# EAGLE design weddingbot (EAGLE 6.1)
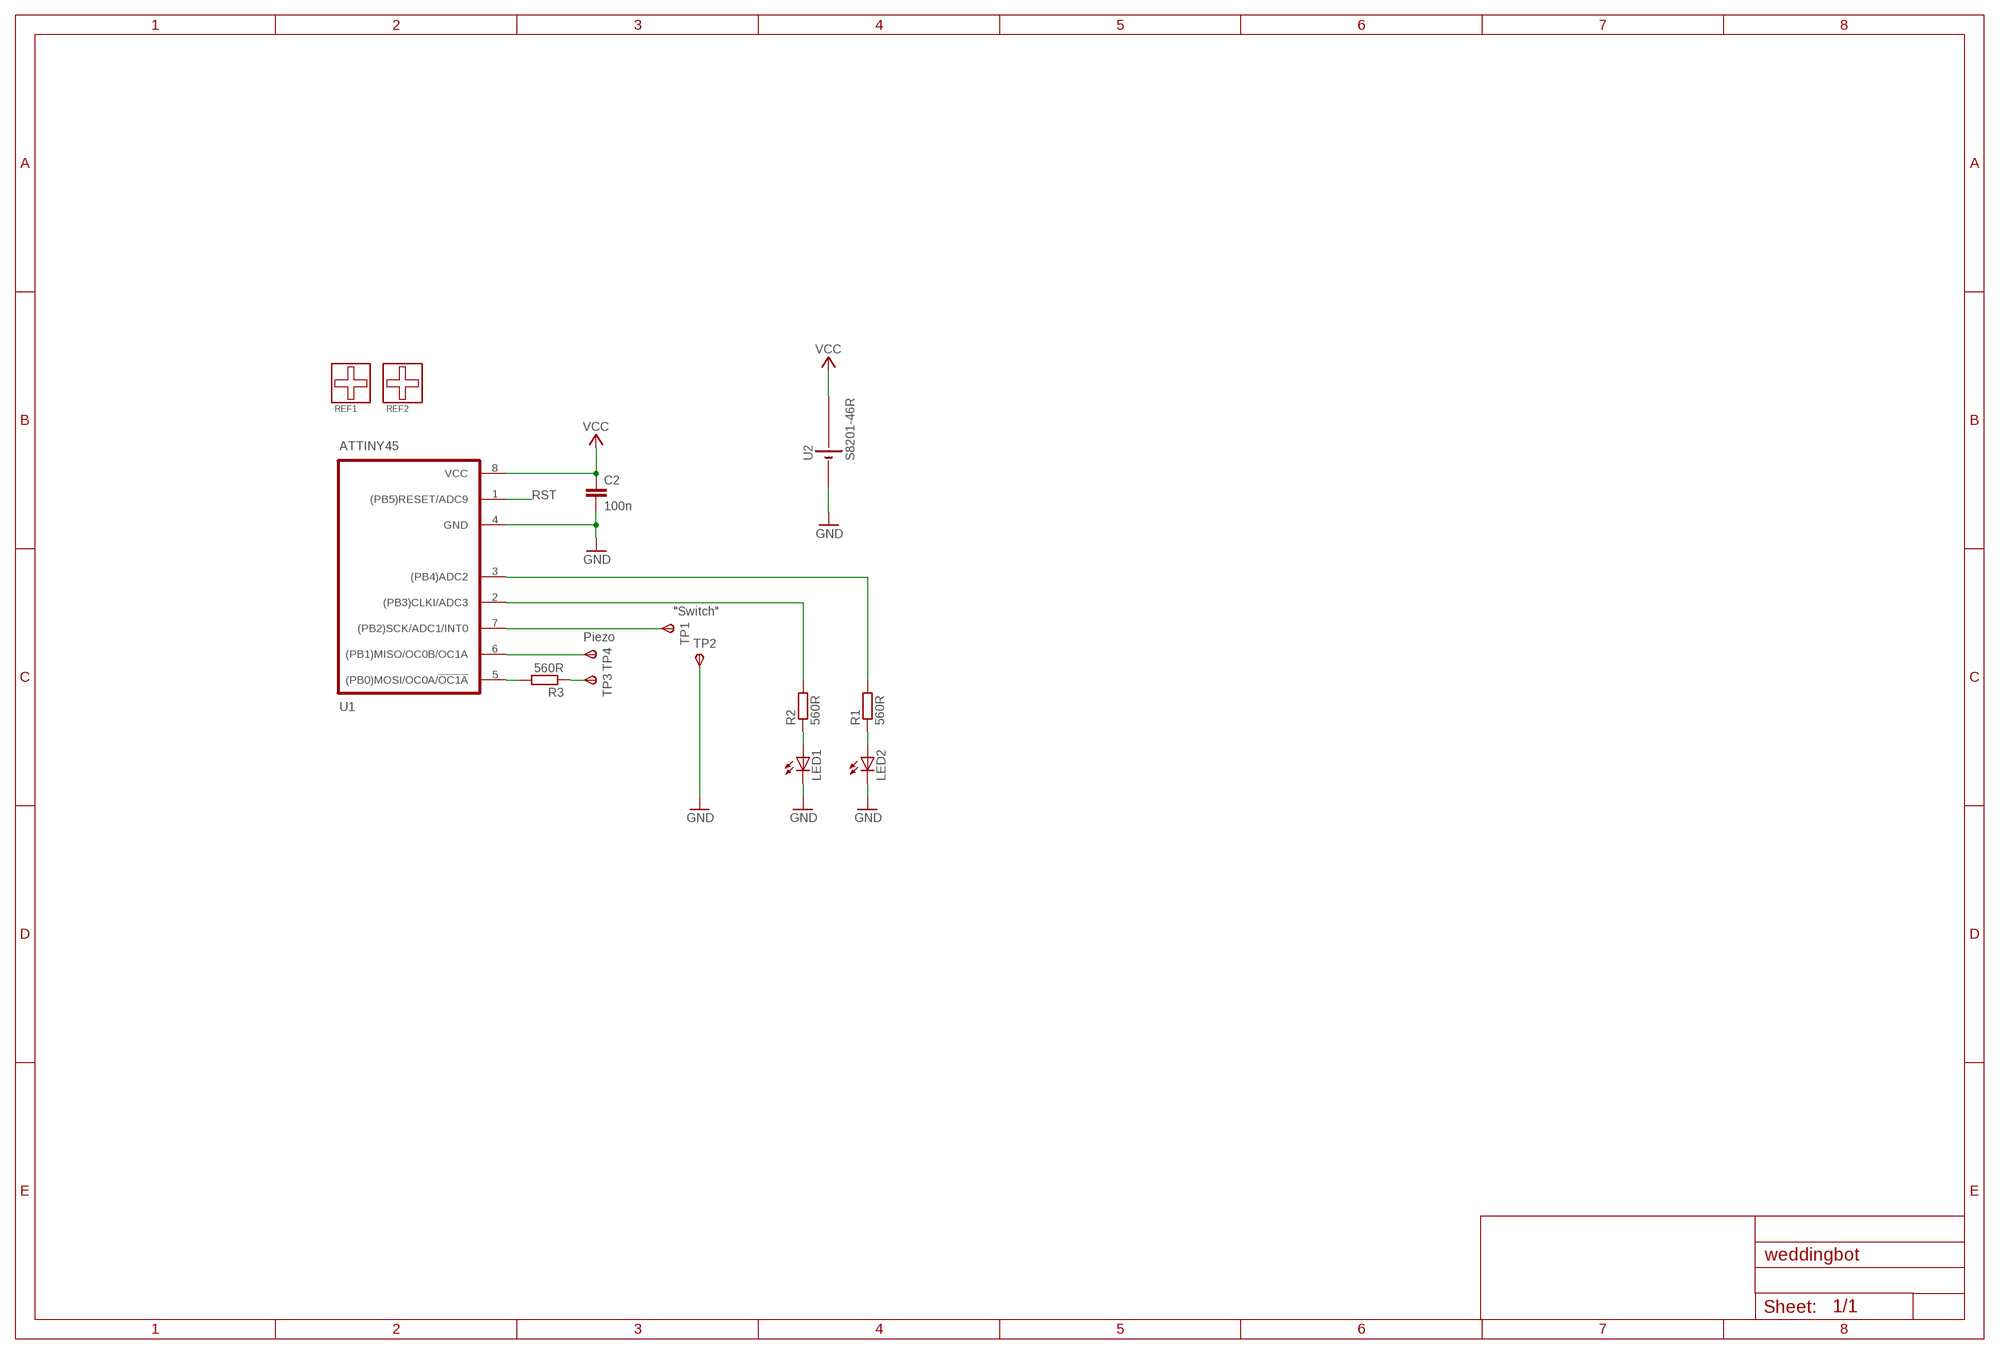
[diagram p0: schematic, sheet 1]

## Parts
C2  100n  C-EUC0603  [C0603]
LED1  LEDMEINE  [CHIPLED_REV_1206]
LED2  LEDMEINE  [CHIPLED_REV_1206]
R1  560R  R-EU_R0603  [R0603]
R2  560R  R-EU_R0603  [R0603]
R3  560R  R-EU_R0603  [R0603]
REF1  FIDUCIAL_ROUND  [REF_ROUND]
REF2  FIDUCIAL_ROUND  [REF_ROUND]
TP1  TPSTP20R  [TP20R]
TP2  TPSTP20R  [TP20R]
TP3  TPSTP20R  [TP20R]
TP4  TPSTP20R  [TP20R]
U1  ATTINY45  [SOIC8]
U2  S8201-46R  [S8201-46R]

## Nets
GND: C2.2 LED1.C LED2.C TP2.TP(PP) U1.4(GND) U2.P1(GND)
N$2: R3.2 U1.5((PB0)MOSI/OC0A/!OC1A)
N$3: LED2.A R1.1
N$4: LED1.A R2.1
N$5: TP1.TP(PP) U1.7((PB2)SCK/ADC1/INT0)
N$6: R3.1 TP3.TP(PP)
N$7: TP4.TP(PP) U1.6((PB1)MISO/OC0B/OC1A)
NET1: R2.2 U1.2((PB3)CLKI/ADC3)
RST: U1.1((PB5)RESET/ADC9)
SCK: R1.2 U1.3((PB4)ADC2)
VCC: C2.1 U1.8(VCC) U2.P2(VV1)
Unconnected: REF1.P$1 REF2.P$1 U2.P3(VV2)

## Notes on the sheet
- "Switch"
- Piezo

## Library data of the parts
C2 = rcl:C-EU: CAPACITOR, European symbol
LED1 LED2 = led_rev:LED: LED OSRAM: - CHIPLED LG R971, LG N971, LY N971, LG Q971, LY Q971, LO R971, LY R971 LH N974, LH R974 LS Q976, LO Q976, LY Q976 LO Q996 - Hyper CHIPLED LW Q18S LB Q993, LB Q99A, LB R99A - SideLED LS A670, LO A670, LY A670, LG A670, LP A670 LB A673, LV A673, LT A673, LW A673 LH A674 LY A675 LS A676, LA A676, LO A676, LY A676, LW A676 LS A679, LY A679, LG A679 - Hyper Micro SIDELED® LS Y876, LA Y876, LO Y876, LY Y876 LT Y87S - SmartLED LW L88C, LW L88S LB L89C, LB L89S, LG L890 LS L89K, LO L89K, LY L89K LS L896, LA L896, LO L896, LY L896 - TOPLED LS T670, LO T670, LY T670, LG T670, LP T670 LSG T670, LSP T670, LSY T670, LOP T670, LYG T670 LG T671, LOG T671, LSG T671 LB T673, LV T673, LT T673, LW T673 LH T674 LS T676, LA T676, LO T676, LY T676, LB T676, LH T676, LSB T676, LW T676 LB T67C, LV T67C, LT T67C, LS T67K, LO T67K, LY T67K, LW E67C LS E67B, LA E67B, LO E67B, LY E67B, LB E67C, LV E67C, LT E67C LW T67C LS T679, LY T679, LG T679 LS T770, LO T770, LY T770, LG T770, LP T770 LB T773, LV T773, LT T773, LW T773 LH T774 LS E675, LA E675, LY E675, LS T675 LS T776, LA T776, LO T776, LY T776, LB T776 LHGB T686 LT T68C, LB T68C - Hyper Mini TOPLED® LB M676 - Mini TOPLED Santana® LG M470 LS M47K, LO M47K, LY M47K Source: http://www.osram.convergy.de LUXEON: - LUMILED® LXK2-PW12-R00, LXK2-PW12-S00, LXK2-PW14-U00, LXK2-PW14-V00 LXK2-PM12-R00, LXK2-PM12-S00, LXK2-PM14-U00 LXK2-PE12-Q00, LXK2-PE12-R00, LXK2-PE12-S00, LXK2-PE14-T00, LXK2-PE14-U00 LXK2-PB12-K00, LXK2-PB12-L00, LXK2-PB12-M00, LXK2-PB14-N00, LXK2-PB14-P00, LXK2-PB14-Q00 LXK2-PR12-L00, LXK2-PR12-M00, LXK2-PR14-Q00, LXK2-PR14-R00 LXK2-PD12-Q00, LXK2-PD12-R00, LXK2-PD12-S00 LXK2-PH12-R00, LXK2-PH12-S00 LXK2-PL12-P00, LXK2-PL12-Q00, LXK2-PL12-R00 Source: www.luxeon.com KINGBRIGHT: KA-3528ASYC Source: www.kingbright.com
R1-R3 = rcl:R-EU_: RESISTOR, European symbol
REF1 REF2 = Fiducial:FIDUCIAL_ROUND
TP1-TP4 = testpad:TPS: TEST PIN
U1 = ATTINY13:ATTINY45
U2 = Knopfzellenhalter:S8201-46R

## Board
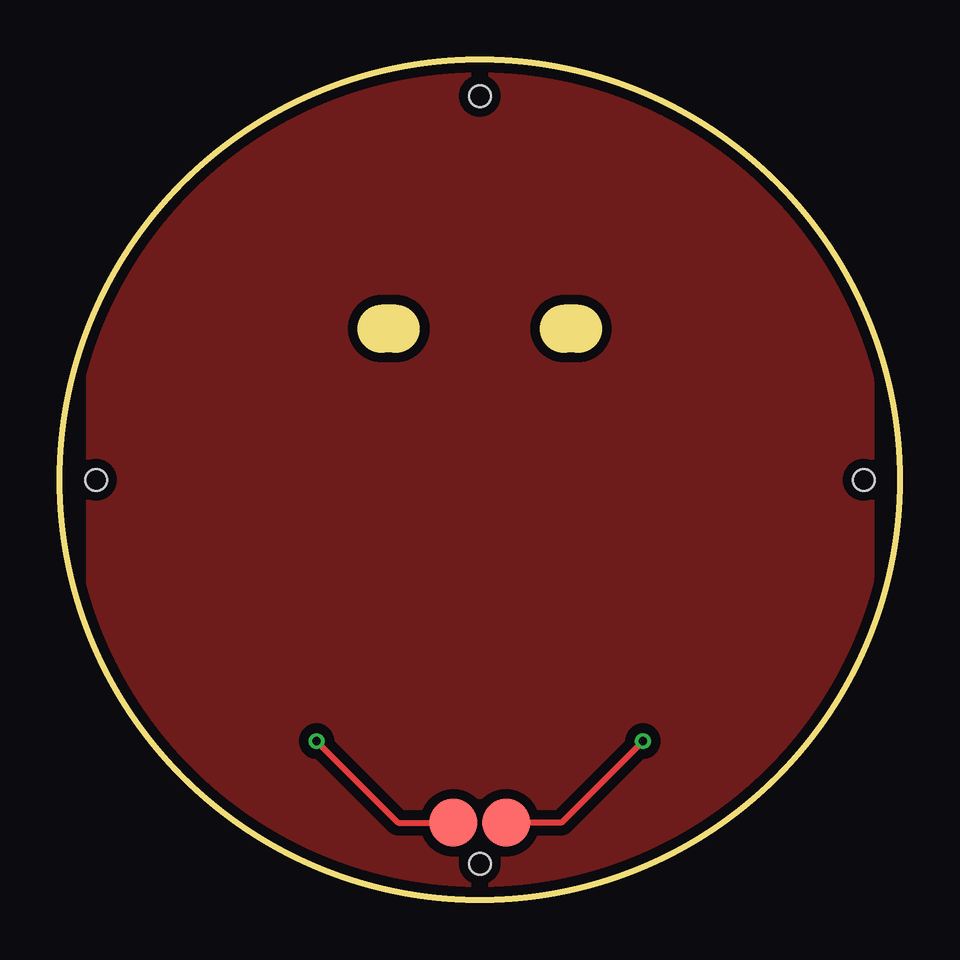
[diagram p1: board, top side]
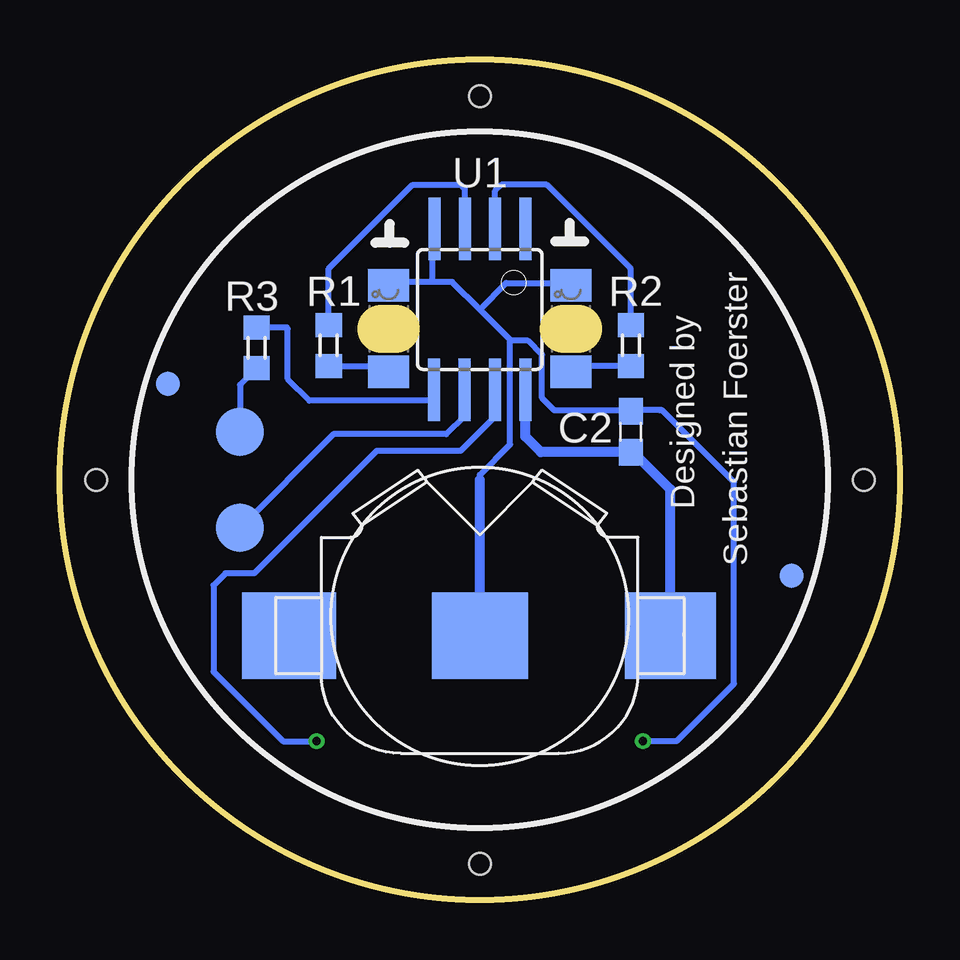
[diagram p2: board, bottom side, seen from below]

Size 35 x 35 mm. Coordinates in mm from the lower left corner, seen from the top.
Outline: circle at 17.5,17.5 radius 17.5
Copper layers (1*16): Top 0.035mm / dielectric 1.5mm / Bottom 0.035mm
Design rules: minimum track width 6mil, minimum drill 12mil, track to track 6mil, track to pad 6mil, pad to pad 6mil, via to via 6mil, smd to smd 0mil, copper to edge 10mil, drill to drill 10mil, minimum pad ring 10mil, minimum via ring 6mil, stop-mask expansion 2mil, vias tented up to drill 14mil, thermal gap 10mil
Holes 0.9 mm at 1.5,17.5 33.5,17.5 17.5,1.5 17.5,33.5
tRestrict: 4 lines

### Footprints (pad centres in the part's own frame; a part is rotated, then mirrored left to right if it is on the bottom)
C0603 = smd 1.1 x 1: 1 -0.85,0; 2 0.85,0
CHIPLED_REV_1206 = smd 1.7 x 1.35: A 0,-1.8; C 0,1.8
R0603 = smd 1 x 1.1: 1 -0.85,0; 2 0.85,0
REF_ROUND = smd 1 x 1: P$1 0,0
TP20R = smd 2 x 2: TP 0,0
SOIC8 = smd 0.5 x 2.6: 1 -1.905,-3.354; 2 -0.645,-3.354; 3 0.625,-3.354; 4 1.895,-3.354; 5 1.905,3.354; 6 0.635,3.354; 7 -0.635,3.354; 8 -1.905,3.354
S8201-46R = smd 4 x 3.6: P1 0,0 | smd 3.8 x 3.6: P2 7.95,0 | smd 3.9 x 3.6: P3 -7.95,0

### Placement (x,y rotation side)
C2  11.2,19.5 90 bottom
LED1  13.7,23.8 0 bottom
LED2  21.3,23.8 0 bottom
R1  23.8,23.1 90 bottom
R2  11.2,23.1 90 bottom
R3  26.8,23 90 bottom
REF1  30.5,21.5 0 bottom
REF2  4.5,13.5 0 bottom
TP1  18.6,3.2 0 top
TP2  16.4,3.2 0 top
TP3  27.5,19.5 0 bottom
TP4  27.5,15.5 0 bottom
U1  17.5,24.6 180 bottom
U2  17.5,11 0 bottom

### Tracks (layer width: path | path; a pad name or v marks a point on that pad's centre or on a via)
GND  (via drill 0.35)
  Top 0.254: v10.7,6.6 14.1,3.2 TP2.TP
  Bottom 0.254: 17.5,24.6 16.4,25.7 13.7,25.7 13.7,25.71 | 17.5,24.6 18.65,25.75 19.5,25.75 | 19.5,25.75 21.3,25.75 LED2.C | U1.4 19.5,27.85 19.5,25.75 | 16.2,23.3 17.5,24.6 | v10.7,6.6 9.3,6.6 6.9,9 6.9,17.4 9.9,20.4 10,20.4 | 16.2,23.3 15.5,23.3 14.9,22.7 14.9,20.9 14.4,20.4 11,20.4 | 13.7,25.75 13.7,25.71 | 13.7,25.71 13.74,25.67 13.74,25.76 | 13.7,25.8 13.74,25.76 | 13.74,25.76 13.79,25.76 13.83,25.8 13.74,25.8 | 13.74,25.8 13.7,25.8 | 13.7,25.8 13.65,25.76 13.7,25.76 13.74,25.8 | LED1.C 13.7,25.8 | 13.7,25.8 | 10,20.4 11,20.4 | C2.2 11,20.4 | 10,20.4 | 17.5,17.5 17.5,17.7 16.23,18.97 16.23,23.3 16.2,23.3
  Bottom 0.406: U2.P1 17.5,17.5
N$1
  pour Top (isolate 0.406): 0,17.5 arc90 17.5,0 arc90 35,17.5 arc180
N$2
  Bottom 0.254: U1.5 19.4,20.7 19.5,20.8 24.6,20.8 25.5,21.7 25.5,23.8 25.55,23.85 R3.2
N$3
  Bottom 0.254: R1.1 21.35,22.25 | 21.35,22.25 21.3,22.25 | LED2.A 21.3,22.2 21.35,22.25
N$4
  Bottom 0.254: R2.1 13.7,22.25 LED1.A
N$5  (via drill 0.35)
  Top 0.254: v24.3,6.6 20.9,3.2 TP1.TP
  Bottom 0.254: U1.7 16.86,20.13 18.3,18.7 21.8,18.7 26.9,13.6 28.1,13.6 28.6,13.1 28.6,9.5 25.7,6.6 v24.3,6.6
N$6
  Bottom 0.254: R3.1 27.5,21.45 TP3.TP
N$7
  Bottom 0.254: U1.6 18.14,20.16 18.9,19.4 23.6,19.4 TP4.TP
NET1
  Bottom 0.254: R2.2 11.2,26.3 14.7,29.8 16.6,29.8 16.86,29.55 U1.2
SCK
  Bottom 0.254: R1.2 23.8,26.3 20.3,29.8 18.3,29.8 18.12,29.62 U1.3
VCC
  Bottom 0.406: U2.P2 9.55,17.1 11.15,18.7 11.2,18.7 | U1.8 15.6,19.3 14.95,18.65 C2.1 11.2,18.7 | 11.2,18.6 11.2,18.7 | 11.2,18.7

### Text on the board
bNames: Sebastian Foerster | Designed by
Notes: Panelize 4x4 Boards | V-Score | V-Score
201bmp: on